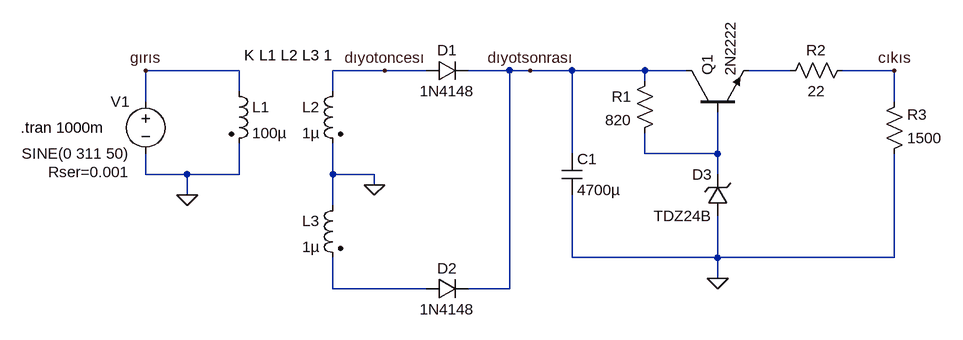
[diagram p0: schematic deney1.asc]
deney1.asc, the LTspice schematic file:
Version 4
SHEET 1 880 680
WIRE -320 144 -464 144
WIRE -96 144 -176 144
WIRE -32 144 -96 144
WIRE 96 144 32 144
WIRE 128 144 96 144
WIRE 192 144 128 144
WIRE 304 144 192 144
WIRE 368 144 304 144
WIRE 528 144 464 144
WIRE 688 144 608 144
WIRE 304 160 304 144
WIRE -320 176 -320 144
WIRE -176 176 -176 144
WIRE -464 192 -464 144
WIRE 688 192 688 144
WIRE 192 272 192 144
WIRE 304 272 304 240
WIRE 416 272 416 208
WIRE 416 272 304 272
WIRE -464 304 -464 272
WIRE -400 304 -464 304
WIRE -320 304 -320 256
WIRE -320 304 -400 304
WIRE -176 304 -176 256
WIRE -112 304 -176 304
WIRE 416 304 416 272
WIRE -112 320 -112 304
WIRE -400 336 -400 304
WIRE -176 352 -176 304
WIRE 192 432 192 336
WIRE 416 432 416 368
WIRE 416 432 192 432
WIRE 688 432 688 272
WIRE 688 432 416 432
WIRE 416 464 416 432
WIRE -176 480 -176 432
WIRE -32 480 -176 480
WIRE 96 480 96 144
WIRE 96 480 32 480
FLAG -400 336 0
FLAG -112 320 0
FLAG 416 464 0
FLAG -464 144 gırıs
FLAG -96 144 dıyotoncesı
FLAG 128 144 dıyotsonrası
FLAG 688 144 cıkıs
SYMBOL ind2 -336 160 R0
SYMATTR InstName L1
SYMATTR Value 100µ
SYMATTR Type ind
SYMBOL ind2 -160 160 M0
SYMATTR InstName L2
SYMATTR Value 1µ
SYMATTR Type ind
SYMBOL voltage -464 176 M0
WINDOW 123 0 0 Left 0
WINDOW 39 24 124 Left 2
SYMATTR SpiceLine Rser=0.001
SYMATTR InstName V1
SYMATTR Value SINE(0 311 50)
SYMBOL ind2 -160 336 M0
SYMATTR InstName L3
SYMATTR Value 1µ
SYMATTR Type ind
SYMBOL diode -32 160 R270
WINDOW 0 32 32 VTop 2
WINDOW 3 0 32 VBottom 2
SYMATTR InstName D1
SYMATTR Value 1N4148
SYMBOL diode -32 496 R270
WINDOW 0 32 32 VTop 2
WINDOW 3 0 32 VBottom 2
SYMATTR InstName D2
SYMATTR Value 1N4148
SYMBOL cap 176 272 R0
SYMATTR InstName C1
SYMATTR Value 4700µ
SYMBOL res 320 144 M0
SYMATTR InstName R1
SYMATTR Value 820
SYMBOL res 624 128 R90
WINDOW 0 0 56 VBottom 2
WINDOW 3 32 56 VTop 2
SYMATTR InstName R2
SYMATTR Value 22
SYMBOL res 672 288 M180
WINDOW 0 36 76 Left 2
WINDOW 3 36 40 Left 2
SYMATTR InstName R3
SYMATTR Value 1500
SYMBOL npn 368 208 R270
SYMATTR InstName Q1
SYMATTR Value 2N2222
SYMBOL zener 432 368 R180
WINDOW 0 24 64 Left 2
WINDOW 3 24 0 Left 2
SYMATTR InstName D3
SYMATTR Value TDZ24B
TEXT -312 120 Left 2 !K L1 L2 L3 1
TEXT -656 232 Left 2 !.tran 1000m

The netlist it stands for:
* deney1.asc
L1 gırıs 0 100µ
L2 dıyotoncesı 0 1µ
V1 gırıs 0 SINE(0 311 50) Rser=0.001
L3 0 N003 1µ
D1 dıyotoncesı dıyotsonrası 1N4148
D2 N003 dıyotsonrası 1N4148
C1 dıyotsonrası 0 4700µ
R1 dıyotsonrası N002 820
R2 cıkıs N001 22
R3 0 cıkıs 1500
Q1 dıyotsonrası N002 N001 0 2N2222
D3 0 N002 TDZ24B
.model D D
.lib standard.dio
.model NPN NPN
.model PNP PNP
.lib standard.bjt
K L1 L2 L3 1
.tran 1000m
.backanno
.end